# EAGLE schematic Adafruit TPA2016D2 (EAGLE 9.6.2)
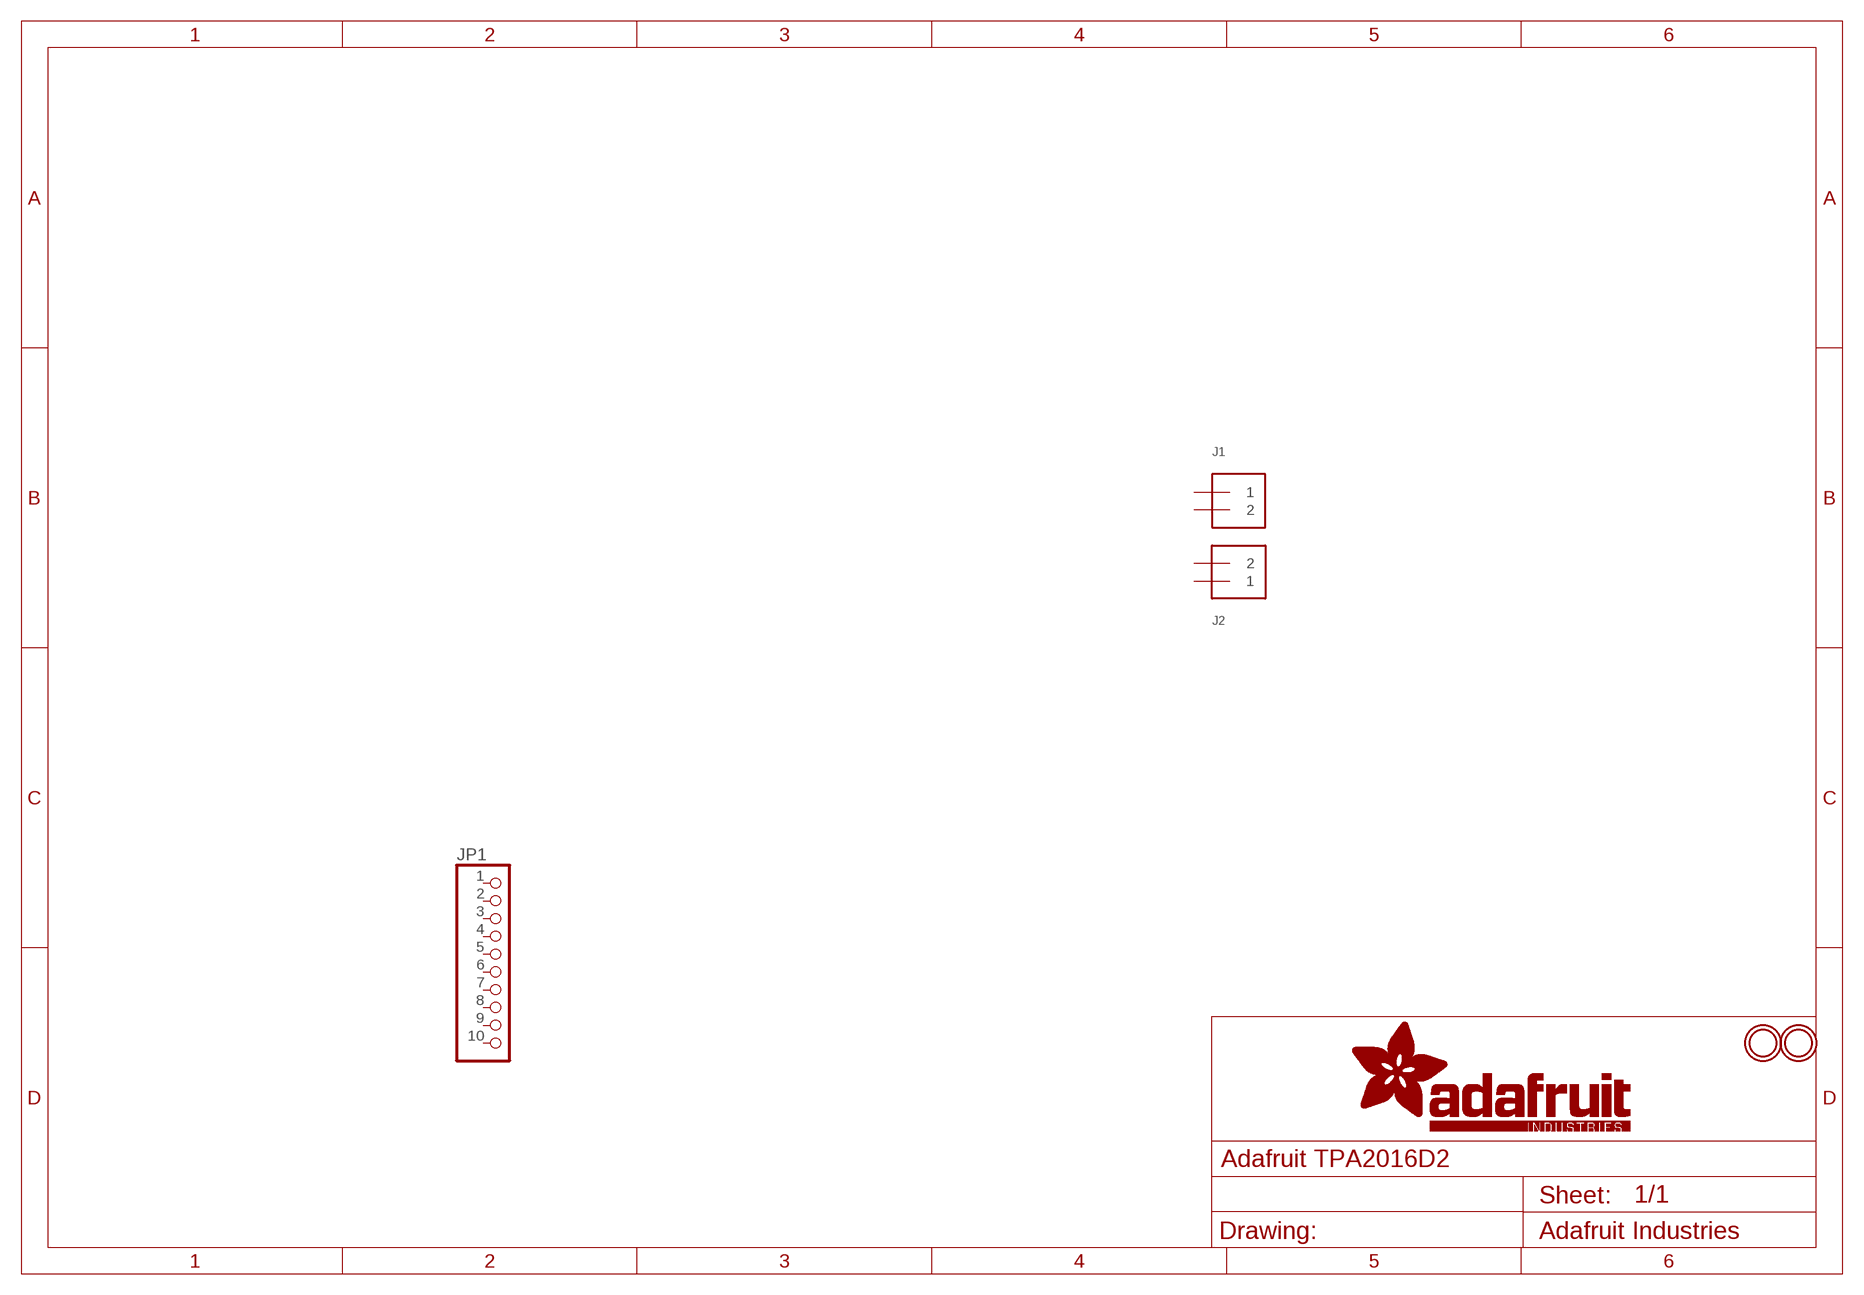
[diagram p0: schematic, sheet 1]

## Parts
J1  TERMBLOCK_1X2  [TERMBLOCK_1X2-3.5MM]
J2  TERMBLOCK_1X2  [TERMBLOCK_1X2-3.5MM]
JP1  HEADER-1X1070MIL  [1X10_ROUND70]
U$20  MOUNTINGHOLE2.5_THICK  [MOUNTINGHOLE_2.5_PLATED_THICK]
U$21  MOUNTINGHOLE2.5_THICK  [MOUNTINGHOLE_2.5_PLATED_THICK]
Unconnected: J1.1 J1.2 J2.1 J2.2 JP1.1 JP1.2 JP1.3 JP1.4 JP1.5 JP1.6 JP1.7 JP1.8 JP1.9 JP1.10

## Library data of the parts
J1 J2 = microbuilder:TERMBLOCK_1X2: 3.5mm Terminal block http://www.ladyada.net/library/pcb/eaglelibrary.html
JP1 = microbuilder:HEADER-1X10: PIN HEADER
U$20 U$21 = microbuilder:MOUNTINGHOLE: Mounting Hole For #2 screws (0.086"/2.18mm width, 0.094"/2.4mm hole) use 2.5mm; BOM: EXCLUDE